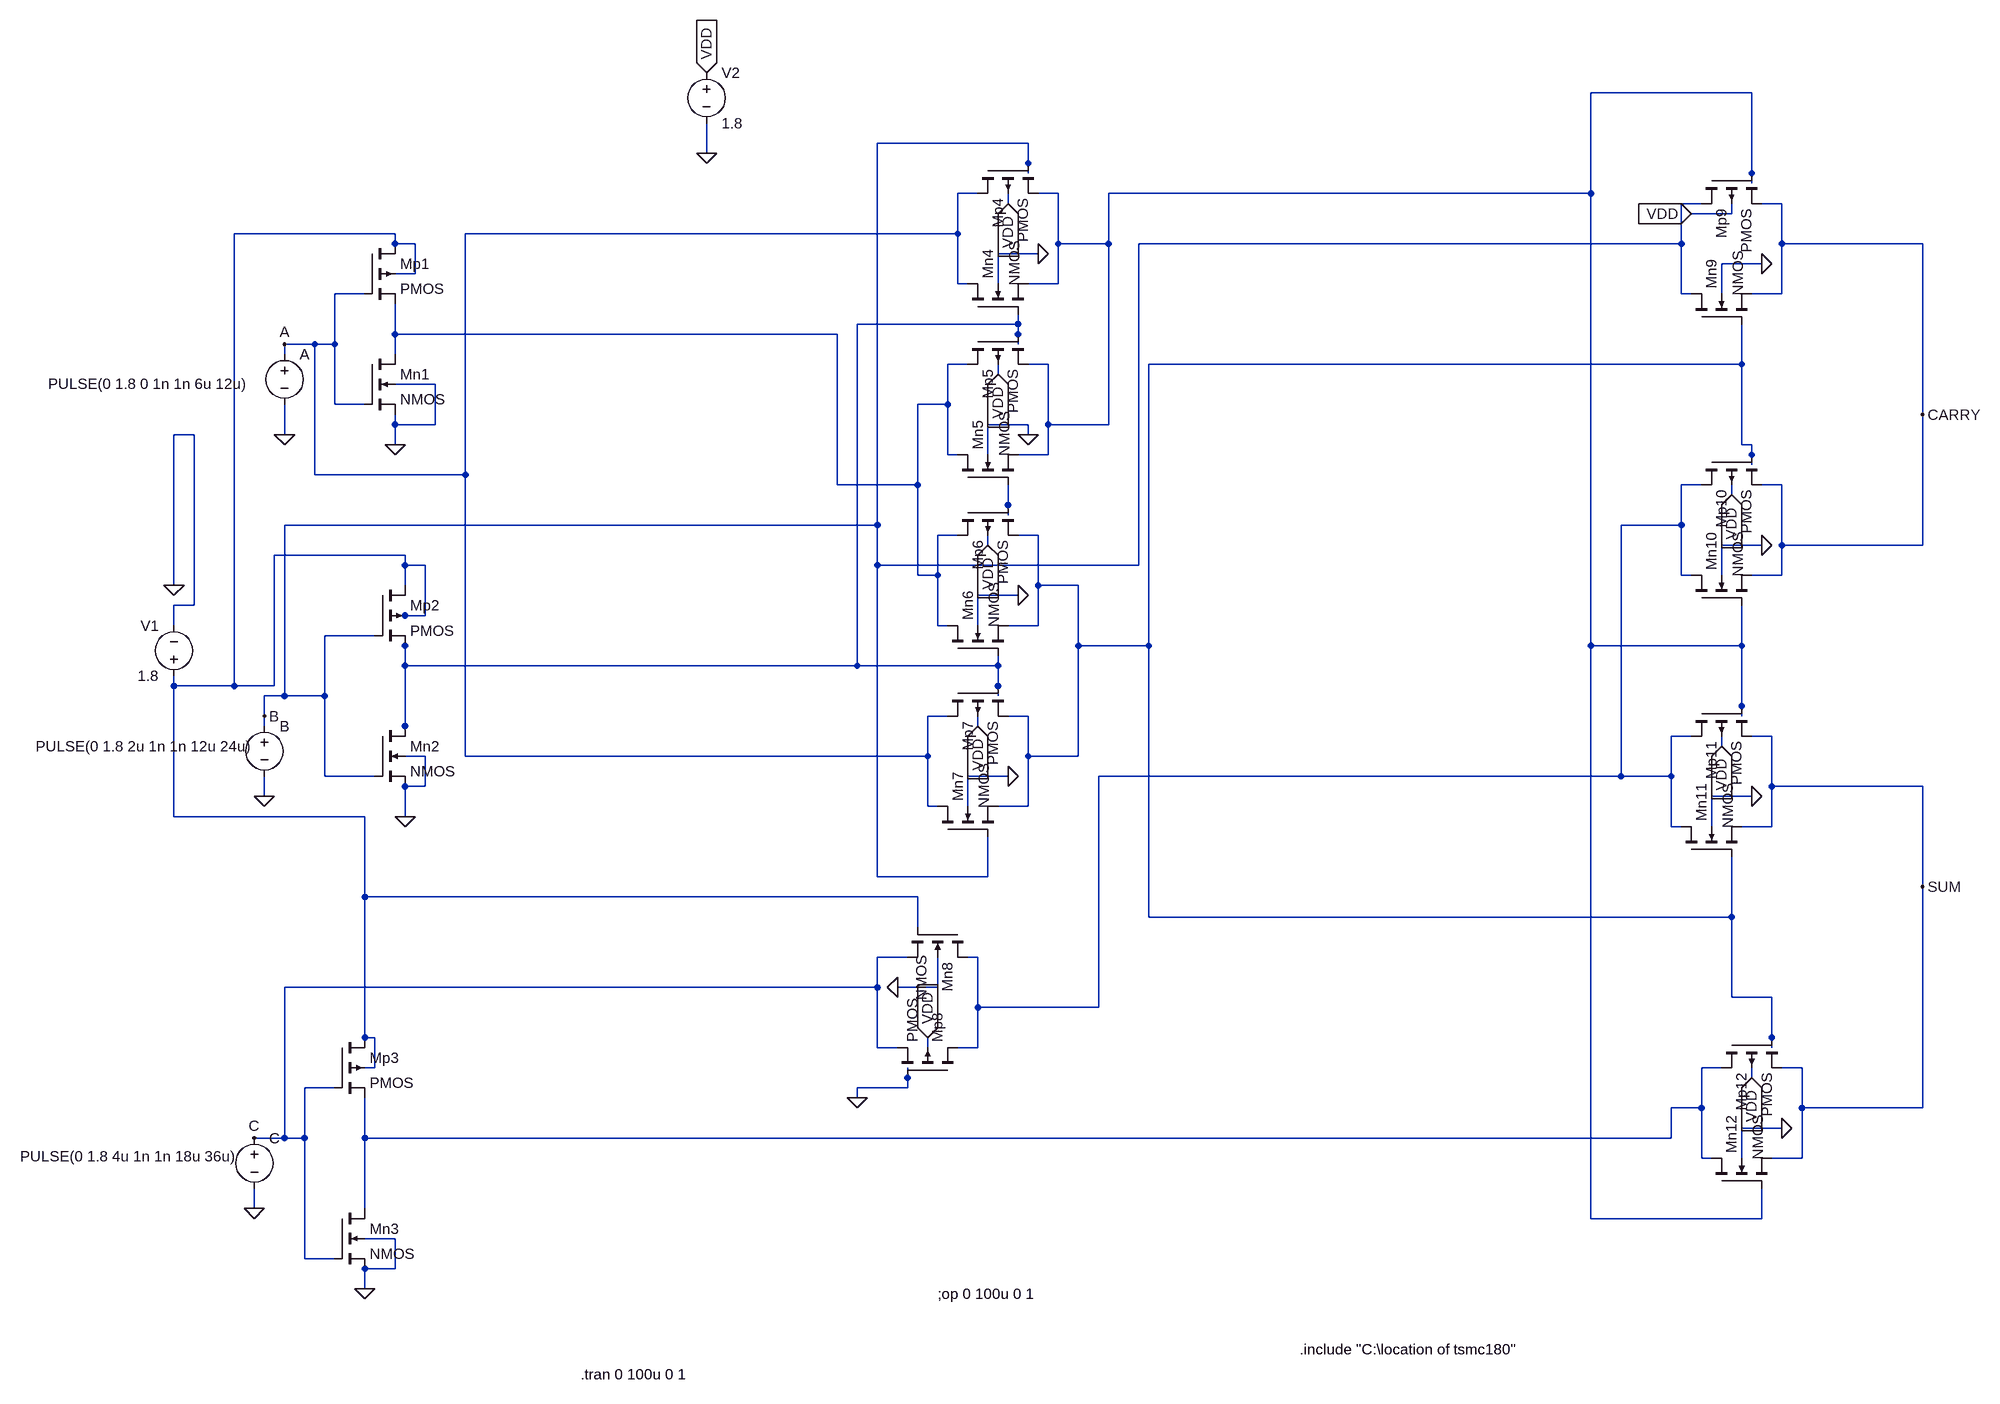
[diagram p0: schematic Draft12.asc]
Draft12.asc, the LTspice schematic file:
Version 4.1
SHEET 1 2152 680
WIRE 1824 -1616 1568 -1616
WIRE 672 -1536 432 -1536
WIRE 160 -1520 160 -1568
WIRE 672 -1504 672 -1536
WIRE 672 -1488 672 -1504
WIRE 1824 -1488 1824 -1616
WIRE 1824 -1472 1824 -1488
WIRE 592 -1456 560 -1456
WIRE 720 -1456 688 -1456
WIRE 1568 -1456 1568 -1616
WIRE 1568 -1456 800 -1456
WIRE 640 -1440 640 -1456
WIRE 1744 -1440 1712 -1440
WIRE 1872 -1440 1840 -1440
WIRE 1792 -1424 1792 -1440
WIRE 1792 -1424 1728 -1424
WIRE -336 -1392 -592 -1392
WIRE 560 -1392 560 -1456
WIRE 560 -1392 -224 -1392
WIRE -336 -1376 -336 -1392
WIRE -304 -1376 -336 -1376
WIRE 720 -1376 720 -1456
WIRE 800 -1376 800 -1456
WIRE 800 -1376 720 -1376
WIRE 1712 -1376 1712 -1440
WIRE 1712 -1376 848 -1376
WIRE 1872 -1376 1872 -1440
WIRE 2096 -1376 1872 -1376
WIRE 688 -1360 624 -1360
WIRE 1840 -1344 1776 -1344
WIRE -304 -1328 -304 -1376
WIRE -304 -1328 -336 -1328
WIRE 560 -1312 560 -1392
WIRE 576 -1312 560 -1312
WIRE 624 -1312 624 -1360
WIRE 720 -1312 720 -1376
WIRE 720 -1312 672 -1312
WIRE -384 -1296 -432 -1296
WIRE 1712 -1296 1712 -1376
WIRE 1728 -1296 1712 -1296
WIRE 1776 -1296 1776 -1344
WIRE 1872 -1296 1872 -1376
WIRE 1872 -1296 1824 -1296
WIRE 656 -1248 656 -1264
WIRE 656 -1248 400 -1248
WIRE -336 -1232 -336 -1280
WIRE 368 -1232 -336 -1232
WIRE 656 -1232 656 -1248
WIRE -464 -1216 -512 -1216
WIRE -432 -1216 -432 -1296
WIRE -432 -1216 -464 -1216
WIRE 656 -1216 656 -1232
WIRE -512 -1200 -512 -1216
WIRE -336 -1200 -336 -1232
WIRE 576 -1184 544 -1184
WIRE 704 -1184 672 -1184
WIRE 1808 -1184 1808 -1248
WIRE 1808 -1184 864 -1184
WIRE 624 -1168 624 -1184
WIRE -272 -1152 -336 -1152
WIRE -432 -1120 -432 -1216
WIRE -384 -1120 -432 -1120
WIRE 544 -1120 544 -1184
WIRE 544 -1120 496 -1120
WIRE 2096 -1104 2096 -1376
WIRE -336 -1088 -336 -1104
WIRE -272 -1088 -272 -1152
WIRE -272 -1088 -336 -1088
WIRE 672 -1088 608 -1088
WIRE 704 -1088 704 -1184
WIRE 800 -1088 800 -1376
WIRE 800 -1088 704 -1088
WIRE -656 -1072 -688 -1072
WIRE -512 -1072 -512 -1120
WIRE 672 -1072 672 -1088
WIRE -336 -1056 -336 -1088
WIRE 1808 -1056 1808 -1184
WIRE 1824 -1056 1808 -1056
WIRE 544 -1040 544 -1120
WIRE 560 -1040 544 -1040
WIRE 608 -1040 608 -1088
WIRE 704 -1040 704 -1088
WIRE 704 -1040 656 -1040
WIRE 1824 -1040 1824 -1056
WIRE 1824 -1024 1824 -1040
WIRE -464 -1008 -464 -1216
WIRE -224 -1008 -224 -1392
WIRE -224 -1008 -464 -1008
WIRE 368 -992 368 -1232
WIRE 496 -992 496 -1120
WIRE 496 -992 368 -992
WIRE 1744 -992 1712 -992
WIRE 1872 -992 1840 -992
WIRE 1792 -976 1792 -992
WIRE 640 -960 640 -992
WIRE 640 -944 640 -960
WIRE 432 -928 432 -1536
WIRE 432 -928 -512 -928
WIRE 1712 -928 1712 -992
WIRE 1712 -928 1616 -928
WIRE 560 -912 528 -912
WIRE 688 -912 656 -912
WIRE 608 -896 608 -912
WIRE 1840 -896 1776 -896
WIRE 1872 -896 1872 -992
WIRE 2096 -896 2096 -1104
WIRE 2096 -896 1872 -896
WIRE -320 -880 -528 -880
WIRE -320 -864 -320 -880
WIRE -288 -864 -320 -864
WIRE 432 -864 432 -928
WIRE 848 -864 848 -1376
WIRE 848 -864 432 -864
WIRE 496 -848 496 -992
WIRE 528 -848 528 -912
WIRE 528 -848 496 -848
WIRE 1712 -848 1712 -928
WIRE 1728 -848 1712 -848
WIRE 1776 -848 1776 -896
WIRE 1872 -848 1872 -896
WIRE 1872 -848 1824 -848
WIRE -688 -832 -688 -1072
WIRE -320 -832 -320 -864
WIRE 688 -832 688 -912
WIRE 752 -832 688 -832
WIRE 656 -816 592 -816
WIRE -656 -800 -656 -1072
WIRE -656 -800 -688 -800
WIRE -320 -784 -336 -784
WIRE -288 -784 -288 -864
WIRE -288 -784 -320 -784
WIRE -688 -768 -688 -800
WIRE 528 -768 528 -848
WIRE 544 -768 528 -768
WIRE 592 -768 592 -816
WIRE 688 -768 688 -832
WIRE 688 -768 640 -768
WIRE -368 -752 -448 -752
WIRE -320 -736 -320 -752
WIRE 752 -736 752 -832
WIRE 864 -736 864 -1184
WIRE 864 -736 752 -736
WIRE 1568 -736 1568 -1456
WIRE 1808 -736 1808 -800
WIRE 1808 -736 1568 -736
WIRE -320 -704 -320 -736
WIRE 400 -704 400 -1248
WIRE 400 -704 -320 -704
WIRE 624 -704 624 -720
WIRE 624 -704 400 -704
WIRE -688 -672 -688 -688
WIRE -592 -672 -592 -1392
WIRE -592 -672 -688 -672
WIRE -528 -672 -528 -880
WIRE -528 -672 -592 -672
WIRE 624 -672 624 -704
WIRE -512 -656 -512 -928
WIRE -512 -656 -544 -656
WIRE -448 -656 -448 -752
WIRE -448 -656 -512 -656
WIRE 624 -656 624 -672
WIRE 1808 -640 1808 -736
WIRE -544 -624 -544 -656
WIRE 544 -624 512 -624
WIRE 672 -624 640 -624
WIRE 1808 -624 1808 -640
WIRE -544 -608 -544 -624
WIRE -320 -608 -320 -704
WIRE 592 -608 592 -624
WIRE -320 -592 -320 -608
WIRE 1728 -592 1696 -592
WIRE 1856 -592 1824 -592
WIRE 1776 -576 1776 -592
WIRE -288 -560 -320 -560
WIRE -224 -560 -224 -1008
WIRE 512 -560 512 -624
WIRE 512 -560 -224 -560
WIRE 672 -560 672 -624
WIRE 752 -560 752 -736
WIRE 752 -560 672 -560
WIRE -448 -528 -448 -656
WIRE -368 -528 -448 -528
WIRE 640 -528 576 -528
WIRE 1616 -528 1616 -928
WIRE 1616 -528 784 -528
WIRE 1696 -528 1696 -592
WIRE 1696 -528 1616 -528
WIRE -320 -512 -320 -528
WIRE -288 -512 -288 -560
WIRE -288 -512 -320 -512
WIRE 1856 -512 1856 -592
WIRE 2096 -512 1856 -512
WIRE -544 -496 -544 -528
WIRE 1824 -496 1760 -496
WIRE 512 -480 512 -560
WIRE 528 -480 512 -480
WIRE 576 -480 576 -528
WIRE 672 -480 672 -560
WIRE 672 -480 624 -480
WIRE -688 -464 -688 -672
WIRE -384 -464 -688 -464
WIRE -320 -464 -320 -512
WIRE 1696 -448 1696 -528
WIRE 1712 -448 1696 -448
WIRE 1760 -448 1760 -496
WIRE 1856 -448 1856 -512
WIRE 1856 -448 1808 -448
WIRE 432 -368 432 -864
WIRE 608 -368 608 -432
WIRE 608 -368 432 -368
WIRE 2096 -352 2096 -512
WIRE -384 -336 -384 -464
WIRE 496 -336 -384 -336
WIRE 864 -304 864 -736
WIRE 1792 -304 1792 -400
WIRE 1792 -304 864 -304
WIRE 496 -288 496 -336
WIRE 480 -240 432 -240
WIRE 592 -240 576 -240
WIRE 432 -192 432 -240
WIRE 432 -192 -512 -192
WIRE 528 -192 528 -240
WIRE 528 -192 464 -192
WIRE 1792 -176 1792 -304
WIRE 1856 -176 1792 -176
WIRE 592 -160 592 -240
WIRE 784 -160 784 -528
WIRE 784 -160 592 -160
WIRE -384 -112 -384 -336
WIRE -368 -112 -384 -112
WIRE 1856 -112 1856 -176
WIRE 432 -96 432 -192
WIRE 464 -96 432 -96
WIRE 512 -96 512 -112
WIRE 592 -96 592 -160
WIRE 592 -96 560 -96
WIRE 1856 -96 1856 -112
WIRE -368 -64 -368 -112
WIRE -368 -64 -384 -64
WIRE 1776 -64 1744 -64
WIRE 1904 -64 1872 -64
WIRE 480 -48 480 -64
WIRE 1824 -48 1824 -64
WIRE -432 -32 -480 -32
WIRE 480 -32 480 -48
WIRE 480 -32 400 -32
WIRE 400 -16 400 -32
WIRE 1744 0 1744 -64
WIRE 1744 0 1696 0
WIRE 1904 0 1904 -64
WIRE 2096 0 2096 -352
WIRE 2096 0 1904 0
WIRE 1872 32 1808 32
WIRE -512 48 -512 -192
WIRE -512 48 -560 48
WIRE -480 48 -480 -32
WIRE -480 48 -512 48
WIRE -384 48 -384 -16
WIRE 1696 48 1696 0
WIRE 1696 48 -384 48
WIRE 1744 80 1744 0
WIRE 1760 80 1744 80
WIRE 1808 80 1808 32
WIRE 1904 80 1904 0
WIRE 1904 80 1856 80
WIRE -560 160 -560 128
WIRE -384 160 -384 48
WIRE 1568 176 1568 -736
WIRE 1840 176 1840 128
WIRE 1840 176 1568 176
WIRE -336 208 -384 208
WIRE -480 240 -480 48
WIRE -432 240 -480 240
WIRE -336 256 -336 208
WIRE -336 256 -384 256
WIRE -384 288 -384 256
FLAG -384 288 0
FLAG -688 -832 0
FLAG -560 160 0
FLAG -320 -464 0
FLAG -544 -496 0
FLAG -336 -1056 0
FLAG -512 -1072 0
FLAG 400 -16 0
FLAG -560 48 C
FLAG -544 -624 B
FLAG -512 -1216 A
FLAG 2096 -352 SUM
FLAG 2096 -1104 CARRY
FLAG 640 -1440 VDD
IOPIN 640 -1440 In
FLAG 624 -1168 VDD
IOPIN 624 -1168 In
FLAG 608 -896 VDD
IOPIN 608 -896 In
FLAG 592 -608 VDD
IOPIN 592 -608 In
FLAG 512 -112 VDD
IOPIN 512 -112 In
FLAG 1728 -1424 VDD
IOPIN 1728 -1424 In
FLAG 1792 -976 VDD
IOPIN 1792 -976 In
FLAG 1776 -576 VDD
IOPIN 1776 -576 In
FLAG 1824 -48 VDD
IOPIN 1824 -48 In
FLAG 688 -1360 0
FLAG 656 -816 0
FLAG 640 -528 0
FLAG 464 -192 0
FLAG 1824 -496 0
FLAG 1840 -896 0
FLAG 1840 -1344 0
FLAG 1872 32 0
FLAG 672 -1072 0
FLAG 160 -1648 VDD
IOPIN 160 -1648 In
FLAG 160 -1520 0
DATAFLAG 560 -368 ""
SYMBOL nmos4 -432 160 R0
SYMATTR InstName Mn3
SYMATTR Value2 l=0.18u w=0.8u
SYMBOL pmos4 -432 -112 R0
SYMATTR InstName Mp3
SYMATTR Value2 l=0.18u w=1.6u
SYMBOL voltage -688 -672 R180
WINDOW 0 24 96 Left 2
WINDOW 3 24 16 Left 2
WINDOW 123 0 0 Left 0
WINDOW 39 0 0 Left 0
SYMATTR InstName V1
SYMATTR Value 1.8
SYMBOL voltage -560 32 R0
WINDOW 123 0 0 Left 0
WINDOW 39 0 0 Left 0
WINDOW 3 -373 45 Left 2
SYMATTR Value PULSE(0 1.8 4u 1n 1n 18u 36u)
SYMATTR InstName C
SYMBOL pmos4 -368 -832 R0
SYMATTR InstName Mp2
SYMATTR Value2 l=0.18u w=3.2u
SYMBOL nmos4 -384 -1200 R0
SYMATTR InstName Mn1
SYMATTR Value2 l=0.18u w=0.4u
SYMBOL pmos4 -384 -1376 R0
SYMATTR InstName Mp1
SYMATTR Value2 l=0.18u w=0.8u
SYMBOL nmos4 -368 -608 R0
SYMATTR InstName Mn2
SYMATTR Value2 l=0.18u w=1.6u
SYMBOL voltage -544 -624 R0
WINDOW 3 -364 48 Left 2
WINDOW 123 0 0 Left 0
WINDOW 39 0 0 Left 0
SYMATTR Value PULSE(0 1.8 2u 1n 1n 12u 24u)
SYMATTR InstName B
SYMBOL voltage -512 -1216 R0
WINDOW 3 -376 63 Left 2
WINDOW 123 0 0 Left 0
WINDOW 39 0 0 Left 0
SYMATTR Value PULSE(0 1.8 0 1n 1n 6u 12u)
SYMATTR InstName A
SYMBOL nmos4 576 -1264 R270
WINDOW 3 45 74 Left 2
SYMATTR InstName Mn4
SYMATTR Value2 l=0.18u w=0.4u
SYMBOL pmos4 592 -1504 M90
SYMATTR InstName Mp4
SYMATTR Value2 l=0.18u w=0.4u
SYMBOL nmos4 560 -992 R270
WINDOW 3 45 74 Left 2
SYMATTR InstName Mn5
SYMATTR Value2 l=0.18u w=0.4u
SYMBOL pmos4 576 -1232 M90
SYMATTR InstName Mp5
SYMATTR Value2 l=0.18u w=0.4u
SYMBOL nmos4 576 -288 R90
WINDOW 3 45 74 Left 2
SYMATTR InstName Mn8
SYMATTR Value2 l=0.36u w=0.4u
SYMBOL pmos4 560 -48 M270
SYMATTR InstName Mp8
SYMATTR Value2 l=0.36u w=0.4u
SYMBOL nmos4 528 -432 R270
WINDOW 3 45 74 Left 2
SYMATTR InstName Mn7
SYMATTR Value2 l=0.18u w=0.4u
SYMBOL pmos4 544 -672 M90
SYMATTR InstName Mp7
SYMATTR Value2 l=0.18u w=0.4u
SYMBOL nmos4 544 -720 R270
WINDOW 3 45 74 Left 2
SYMATTR InstName Mn6
SYMATTR Value2 l=0.18u w=0.4u
SYMBOL pmos4 560 -960 M90
SYMATTR InstName Mp6
SYMATTR Value2 l=0.18u w=0.4u
SYMBOL nmos4 1728 -800 R270
WINDOW 3 45 74 Left 2
SYMATTR InstName Mn10
SYMATTR Value2 l=0.18u w=0.4u
SYMBOL pmos4 1744 -1040 M90
SYMATTR InstName Mp10
SYMATTR Value2 l=0.18u w=0.4u
SYMBOL nmos4 1712 -400 R270
WINDOW 3 45 74 Left 2
SYMATTR InstName Mn11
SYMATTR Value2 l=0.18u w=0.4u
SYMBOL pmos4 1728 -640 M90
SYMATTR InstName Mp11
SYMATTR Value2 l=0.18u w=0.4u
SYMBOL nmos4 1760 128 R270
WINDOW 3 45 74 Left 2
SYMATTR InstName Mn12
SYMATTR Value2 l=0.18u w=0.4u
SYMBOL pmos4 1776 -112 M90
SYMATTR InstName Mp12
SYMATTR Value2 l=0.18u w=0.4u
SYMBOL nmos4 1728 -1248 R270
WINDOW 3 45 74 Left 2
SYMATTR InstName Mn9
SYMATTR Value2 l=0.54u w=0.4u
SYMBOL pmos4 1744 -1488 M90
SYMATTR InstName Mp9
SYMATTR Value2 l=0.54u w=0.4u
SYMBOL voltage 160 -1664 R0
WINDOW 123 0 0 Left 0
WINDOW 39 0 0 Left 0
SYMATTR InstName V2
SYMATTR Value 1.8
TEXT -40 424 Left 2 !.tran 0 100u 0 1
TEXT 528 296 Left 2 !;op 0 100u 0 1
TEXT 1104 384 Left 2 !.include "C:\\location of tsmc180"

The netlist it stands for:
* Draft12.asc
Mn3 N008 C 0 0 NMOS l=0.18u w=0.8u
Mp3 N002 C N008 N002 PMOS l=0.18u w=1.6u
V1 N002 0 1.8
V§C C 0 PULSE(0 1.8 4u 1n 1n 18u 36u)
Mp2 N002 B N003 N002 PMOS l=0.18u w=3.2u
Mn1 N004 A 0 0 NMOS l=0.18u w=0.4u
Mp1 N002 A N004 N002 PMOS l=0.18u w=0.8u
Mn2 N003 B 0 0 NMOS l=0.18u w=1.6u
V§B B 0 PULSE(0 1.8 2u 1n 1n 12u 24u)
V§A A 0 PULSE(0 1.8 0 1n 1n 6u 12u)
Mn4 A N003 N001 0 NMOS l=0.18u w=0.4u
Mp4 A B N001 VDD PMOS l=0.18u w=0.4u
Mn5 N004 N007 N001 0 NMOS l=0.18u w=0.4u
Mp5 N004 N003 N001 VDD PMOS l=0.18u w=0.4u
Mn8 N006 N002 C 0 NMOS l=0.36u w=0.4u
Mp8 N006 0 C VDD PMOS l=0.36u w=0.4u
Mn7 A B N005 0 NMOS l=0.18u w=0.4u
Mp7 A N003 N005 VDD PMOS l=0.18u w=0.4u
Mn6 N004 N003 N005 0 NMOS l=0.18u w=0.4u
Mp6 N004 N007 N005 VDD PMOS l=0.18u w=0.4u
Mn10 N006 N001 CARRY 0 NMOS l=0.18u w=0.4u
Mp10 N006 N005 CARRY VDD PMOS l=0.18u w=0.4u
Mn11 N006 N005 SUM 0 NMOS l=0.18u w=0.4u
Mp11 N006 N001 SUM VDD PMOS l=0.18u w=0.4u
Mn12 N008 N001 SUM 0 NMOS l=0.18u w=0.4u
Mp12 N008 N005 SUM VDD PMOS l=0.18u w=0.4u
Mn9 B N005 CARRY 0 NMOS l=0.54u w=0.4u
Mp9 B N001 CARRY VDD PMOS l=0.54u w=0.4u
V2 VDD 0 1.8
.model NMOS NMOS
.model PMOS PMOS
.lib standard.mos
.tran 0 100u 0 1
;op 0 100u 0 1
.include "C:\location of tsmc180"
.backanno
.end